# Altium schematic sheet 02_Power_Diagram.SchDoc
size A4; SheetNumber: 1; SheetTotal: 8
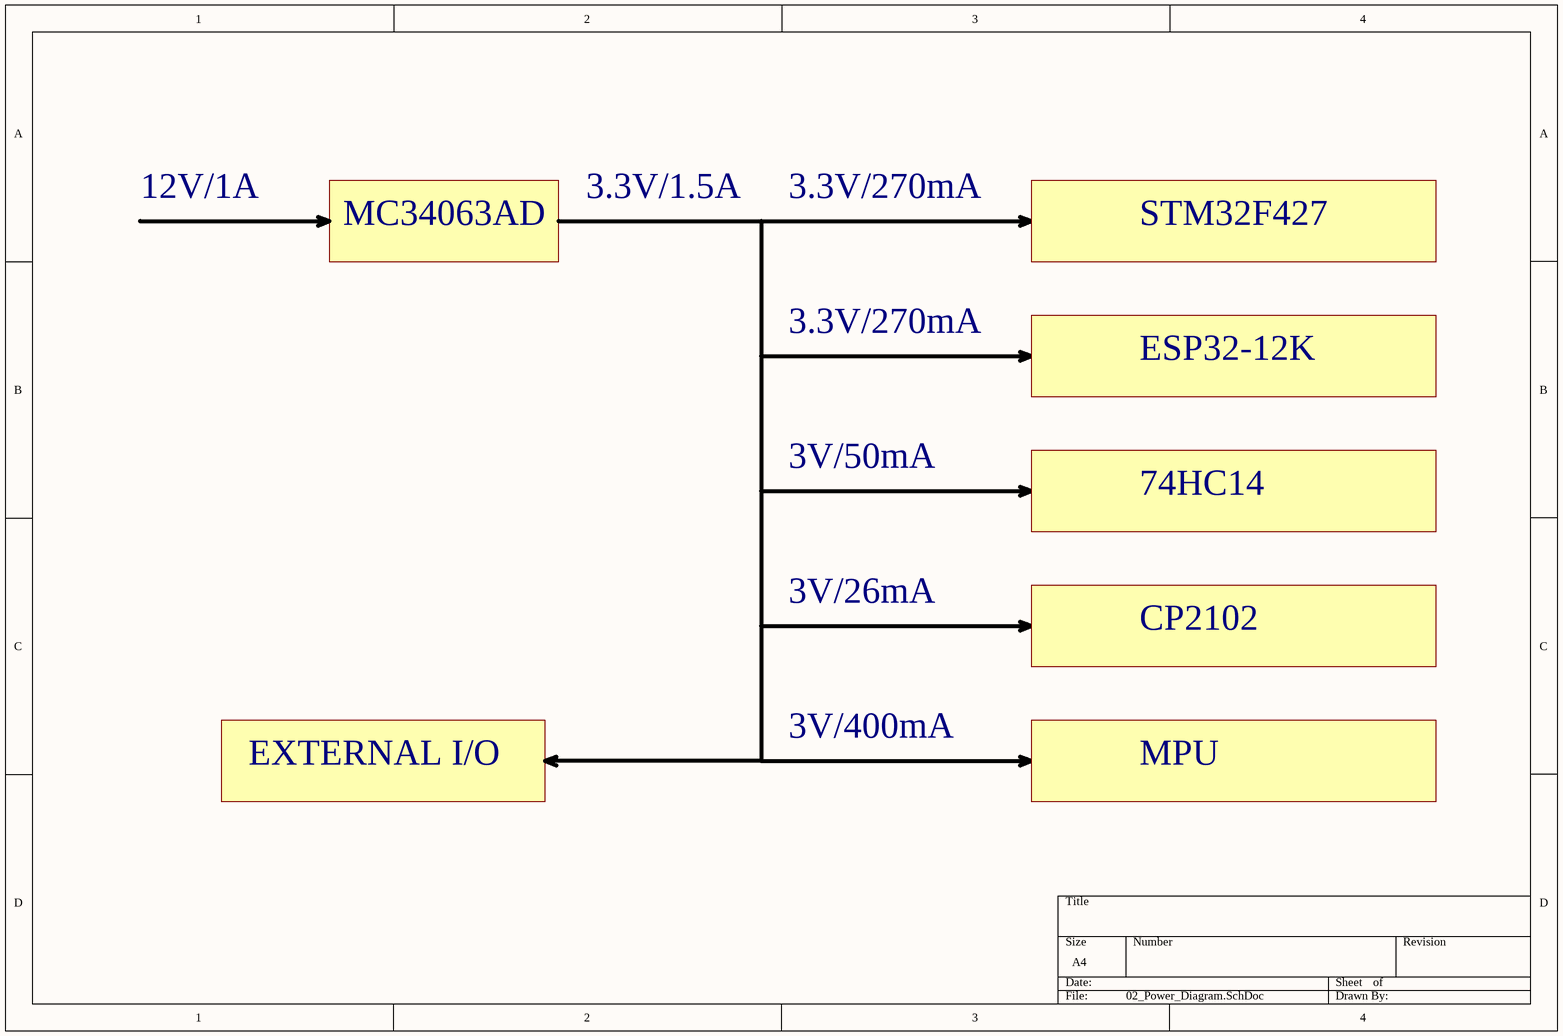
[diagram p0: 02_Power_Diagram.SchDoc]

## Notes on the sheet
- 12V/1A
- MC34063AD
- 3.3V/1.5A
- 3.3V/270mA
- STM32F427
- ESP32-12K
- 3V/50mA
- 74HC14
- 3V/26mA
- CP2102
- EXTERNAL I/O
- 3V/400mA
- MPU